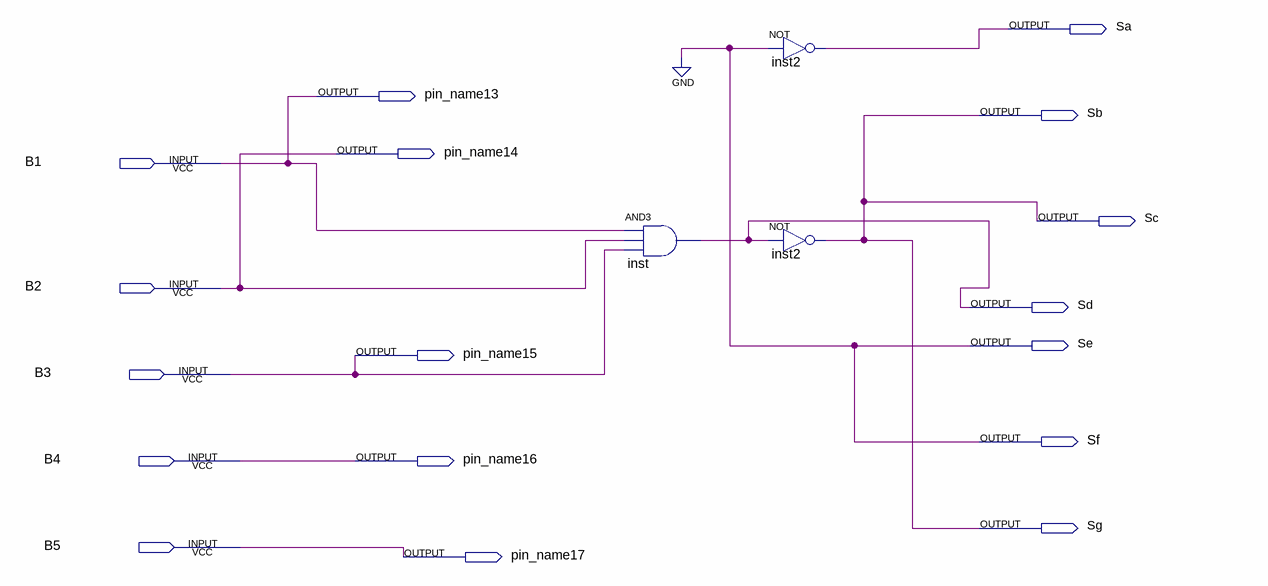
[diagram p0: schematic sheet]
// Quartus schematic LOrH.bdf as structural Verilog: 3 symbols, 17 pins
module LOrH (
  input  B1,
  input  B2,
  input  B3,
  input  B4,
  input  B5,
  output Sa,
  output pin_name13,
  output Sb,
  output pin_name14,
  output Sc,
  output Sd,
  output Se,
  output pin_name15,
  output Sf,
  output pin_name16,
  output Sg,
  output pin_name17
);

  and inst (Sd, B1, B2, B3);
  not inst2 (Sa, 1'b0);
  not inst2_dup2 (Sb, Sd);

  assign pin_name13 = B1;
  assign pin_name14 = B2;
  assign pin_name15 = B3;
  assign pin_name16 = B4;
  assign pin_name17 = B5;
  assign Sc = Sb;
  assign Se = 1'b0;
  assign Sf = 1'b0;
  assign Sg = Sb;
endmodule
